# Altium project UNIT_V3_LVDS_Board.PrjPcb
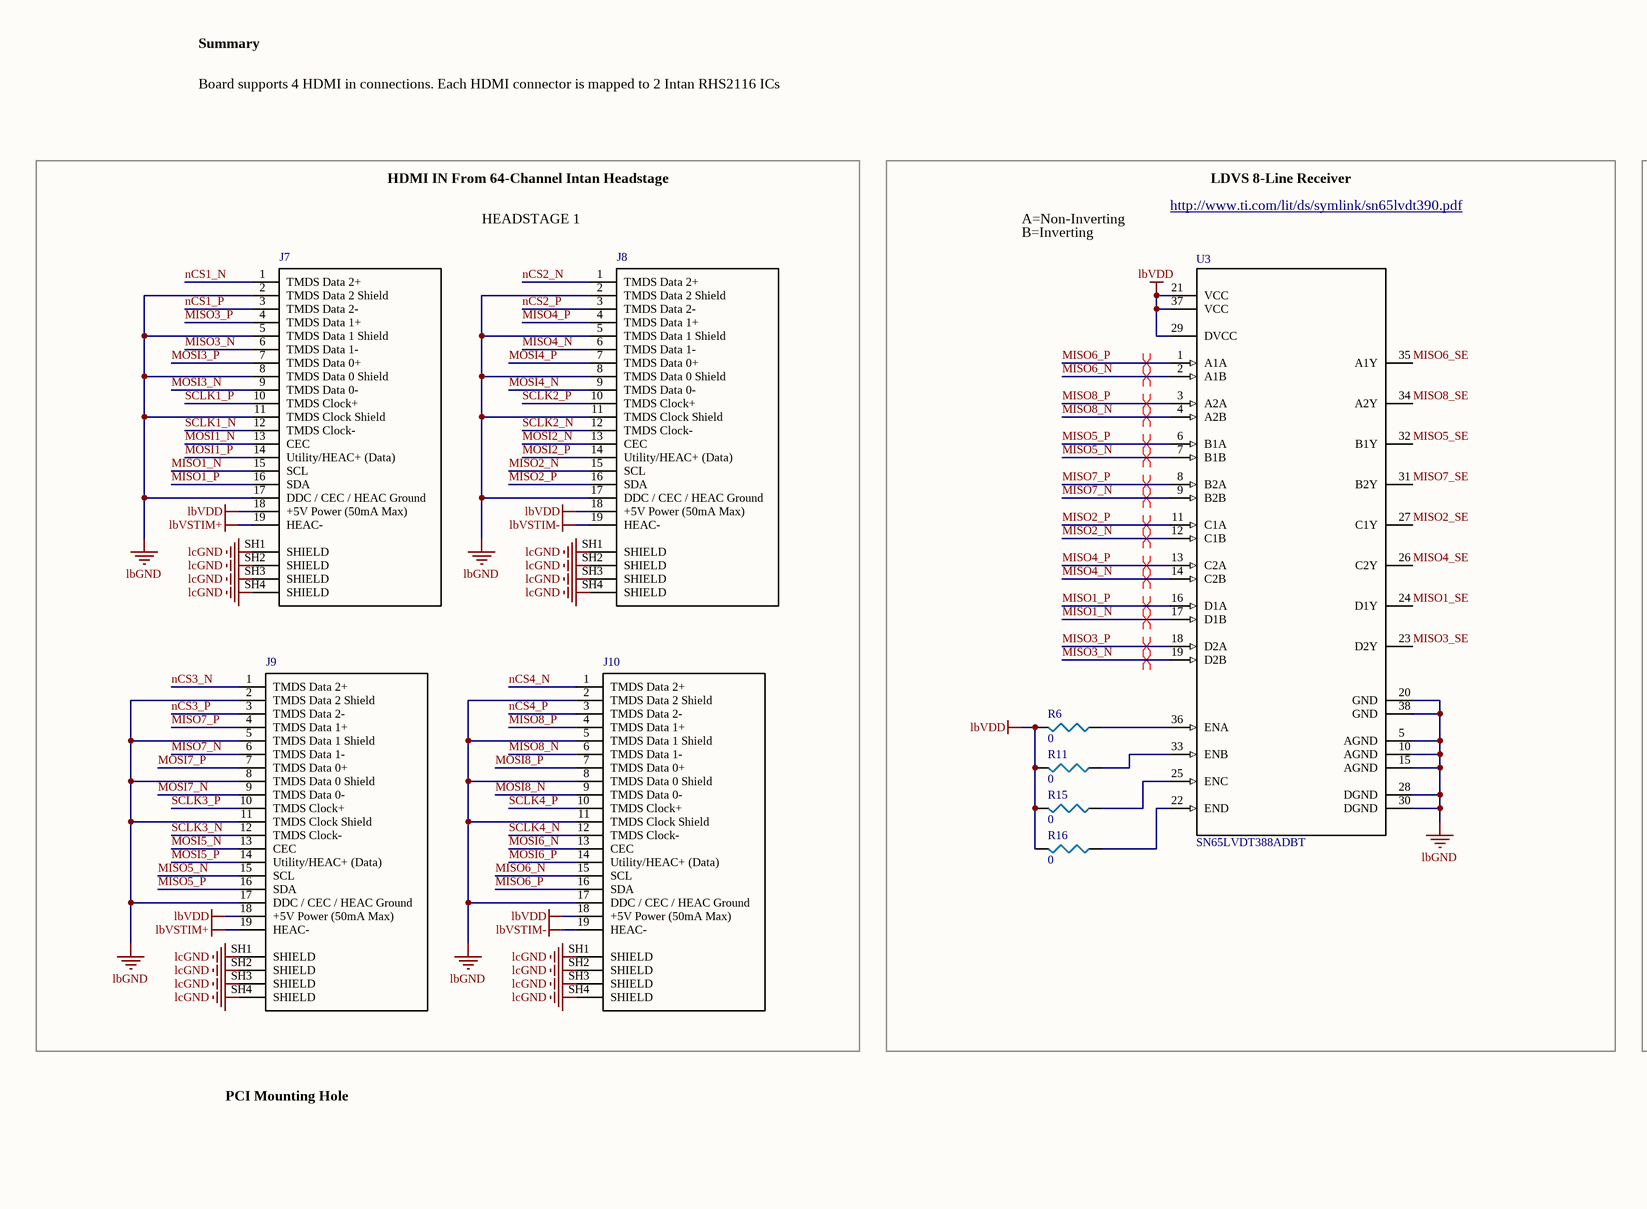
[diagram p0: UNIT_V3_LVDS_Board.SchDoc, left]
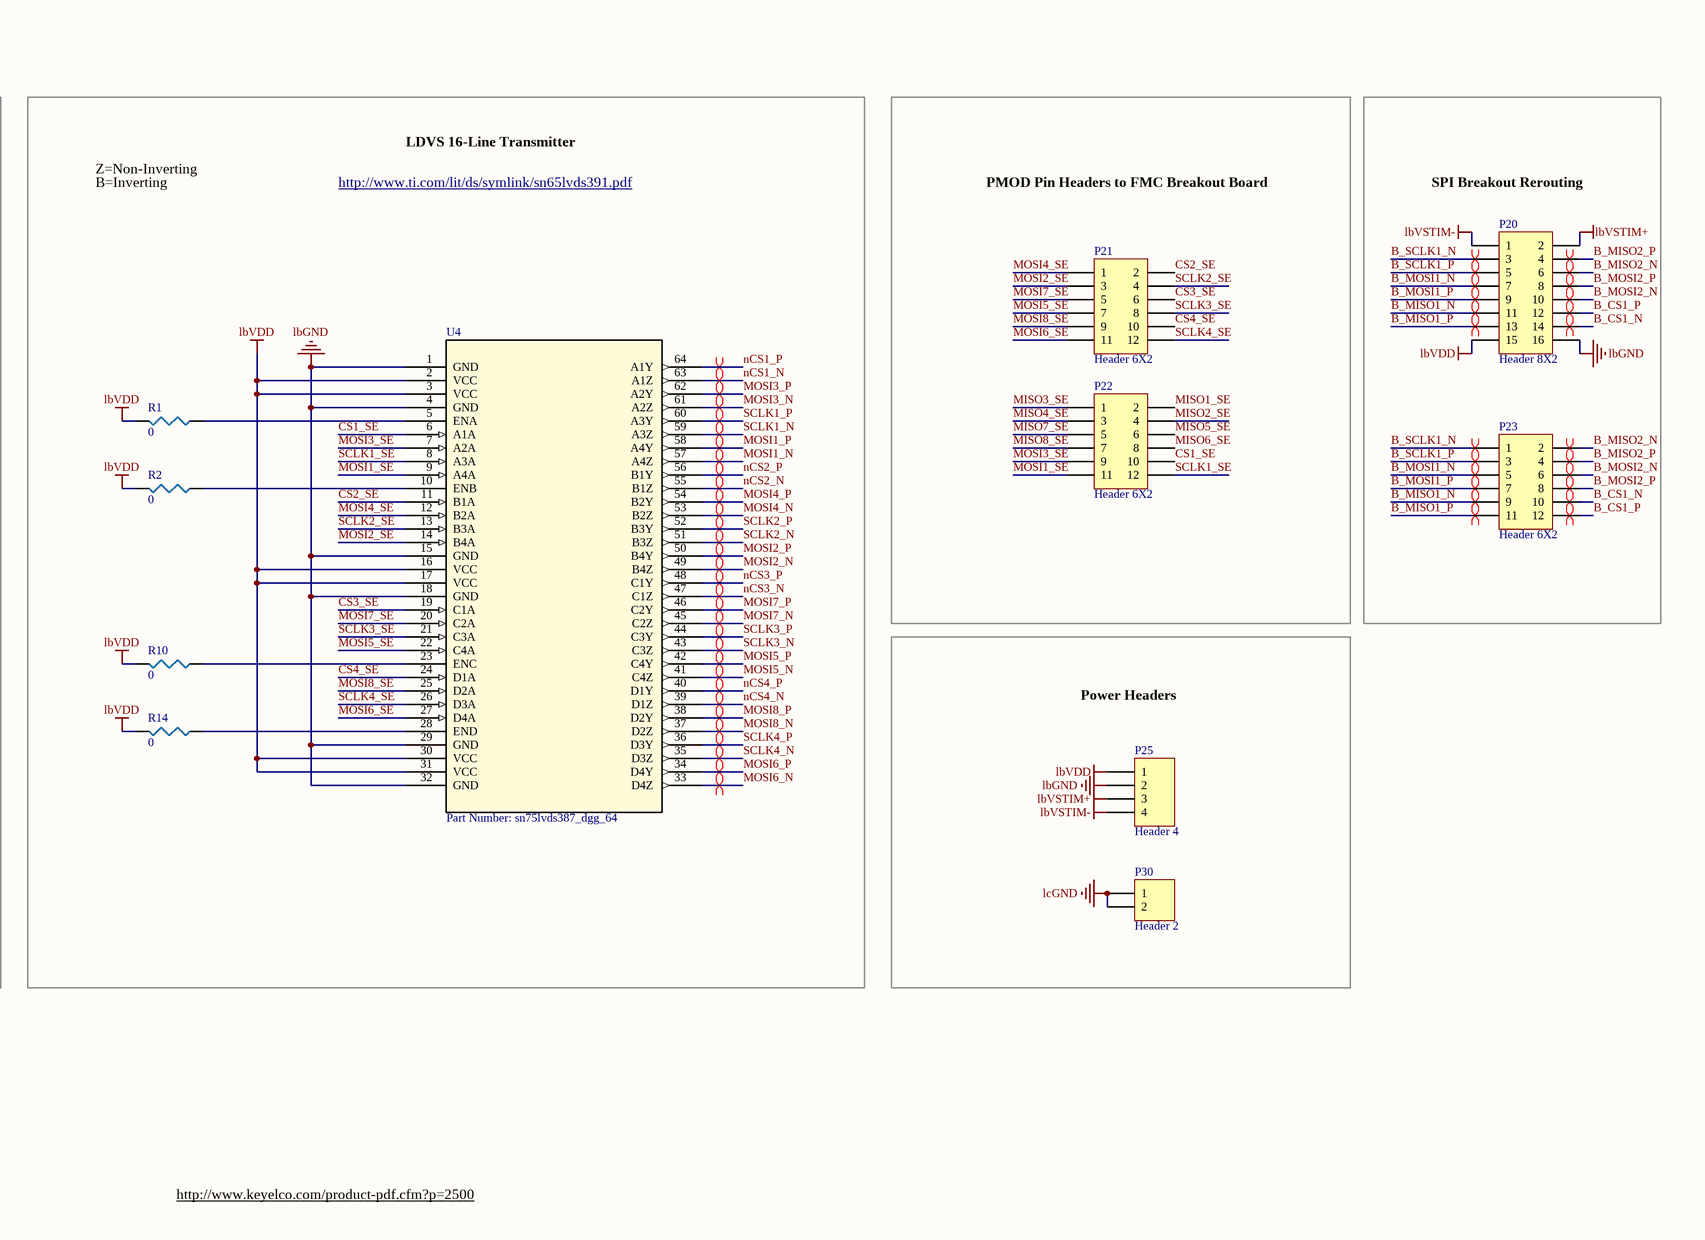
[diagram p1: UNIT_V3_LVDS_Board.SchDoc, right]
1 sheet, 20 parts. Net scope: global (net labels, ports and power ports of the same name join across sheets).
Board file: UNIT_V3_LVDS_Board.PcbDoc

## Sheet UNIT_V3_LVDS_Board.SchDoc
size 635 x 254 mm

### Parts
J7  1747981-2  [TE_1747981-2_1747981-2(Primary)]  (value not drawn)
J8  1747981-2  [TE_1747981-2_1747981-2(Primary)]  (value not drawn)
J9  1747981-2  [TE_1747981-2_1747981-2(Primary)]  (value not drawn)
J10  1747981-2  [TE_1747981-2_1747981-2(Primary)]  (value not drawn)
P20  Header 8X2  [TE_534998-8]
P21  Header 6X2  [0010897120]
P22  Header 6X2  [0010897120]
P23  Header 6X2  [0010897120]
P25  Header 4  [OSTVN04A150]
P30  Header 2  [OSTVN02A150]
R1  0  [R0805]
R2  0  [R0805]
R6  0  [R0805]
R10  0  [R0805]
R11  0  [R0805]
R14  0  [R0805]
R15  0  [R0805]
R16  0  [R0805]
U3  SN65LVDT388ADBT  [DBT0038A_N]
U4  Part Number: sn75lvds387_dgg_64  [DGG64]

### Blocks framed on the sheet
PMOD Pin Headers to FMC Breakout Board: P21 P22
SPI Breakout Rerouting: P20 P23
Power Headers: P25 P30

### Nets
lbGND: J7.2(TMDS_Data_2_Shield) J7.5(TMDS_Data_1_Shield) J7.8(TMDS_Data_0_Shield) J7.11(TMDS_Clock_Shield) J7.17(DDC_/_CEC_/_HEAC_Ground) J8.2(TMDS_Data_2_Shield) J8.5(TMDS_Data_1_Shield) J8.8(TMDS_Data_0_Shield) J8.11(TMDS_Clock_Shield) J8.17(DDC_/_CEC_/_HEAC_Ground) J9.2(TMDS_Data_2_Shield) J9.5(TMDS_Data_1_Shield) J9.8(TMDS_Data_0_Shield) J9.11(TMDS_Clock_Shield) J9.17(DDC_/_CEC_/_HEAC_Ground) J10.2(TMDS_Data_2_Shield) J10.5(TMDS_Data_1_Shield) J10.8(TMDS_Data_0_Shield) J10.11(TMDS_Clock_Shield) J10.17(DDC_/_CEC_/_HEAC_Ground) P20.16 P25.2 U3.5(AGND) U3.10(AGND) U3.15(AGND) U3.20(GND) U3.28(DGND) U3.30(DGND) U3.38(GND) U4.1(GND) U4.4(GND) U4.15(GND) U4.18(GND) U4.29(GND) U4.32(GND)
lbVDD: J7.18(+5V_Power_(50mA_Max)) J8.18(+5V_Power_(50mA_Max)) J9.18(+5V_Power_(50mA_Max)) J10.18(+5V_Power_(50mA_Max)) P20.15 P25.1 R1.2 R2.2 R6.2 R10.2 R11.2 R14.2 R15.2 R16.2 U3.21(VCC) U3.29(DVCC) U3.37(VCC) U4.2(VCC) U4.3(VCC) U4.16(VCC) U4.17(VCC) U4.30(VCC) U4.31(VCC)
lbVSTIM+: J7.19(HEAC-) J9.19(HEAC-) P20.2 P25.3
lbVSTIM-: J8.19(HEAC-) J10.19(HEAC-) P20.1 P25.4
lcGND: J7.SH1(SHIELD) J7.SH2(SHIELD) J7.SH3(SHIELD) J7.SH4(SHIELD) J8.SH1(SHIELD) J8.SH2(SHIELD) J8.SH3(SHIELD) J8.SH4(SHIELD) J9.SH1(SHIELD) J9.SH2(SHIELD) J9.SH3(SHIELD) J9.SH4(SHIELD) J10.SH1(SHIELD) J10.SH2(SHIELD) J10.SH3(SHIELD) J10.SH4(SHIELD) P30.1 P30.2
B_CS1_N: P20.14 P23.10
B_CS1_P: P20.12 P23.12
B_MISO1_N: P20.11 P23.9
B_MISO1_P: P20.13 P23.11
B_MISO2_N: P20.6 P23.2
B_MISO2_P: P20.4 P23.4
B_MOSI1_N: P20.7 P23.5
B_MOSI1_P: P20.9 P23.7
B_MOSI2_N: P20.10 P23.6
B_MOSI2_P: P20.8 P23.8
B_SCLK1_N: P20.3 P23.1
B_SCLK1_P: P20.5 P23.3
CS1_SE: P22.10 U4.6(A1A)
CS2_SE: P21.2 U4.11(B1A)
CS3_SE: P21.6 U4.19(C1A)
CS4_SE: P21.10 U4.24(D1A)
MISO1_N: J7.15(SCL) U3.17(D1B)
MISO1_P: J7.16(SDA) U3.16(D1A)
MISO1_SE: P22.2 U3.24(D1Y)
MISO2_N: J8.15(SCL) U3.12(C1B)
MISO2_P: J8.16(SDA) U3.11(C1A)
MISO2_SE: P22.4 U3.27(C1Y)
MISO3_N: J7.6(TMDS_Data_1-) U3.19(D2B)
MISO3_P: J7.4(TMDS_Data_1+) U3.18(D2A)
MISO3_SE: P22.1 U3.23(D2Y)
MISO4_N: J8.6(TMDS_Data_1-) U3.14(C2B)
MISO4_P: J8.4(TMDS_Data_1+) U3.13(C2A)
MISO4_SE: P22.3 U3.26(C2Y)
MISO5_N: J9.15(SCL) U3.7(B1B)
MISO5_P: J9.16(SDA) U3.6(B1A)
MISO5_SE: P22.6 U3.32(B1Y)
MISO6_N: J10.15(SCL) U3.2(A1B)
MISO6_P: J10.16(SDA) U3.1(A1A)
MISO6_SE: P22.8 U3.35(A1Y)
MISO7_N: J9.6(TMDS_Data_1-) U3.9(B2B)
MISO7_P: J9.4(TMDS_Data_1+) U3.8(B2A)
MISO7_SE: P22.5 U3.31(B2Y)
MISO8_N: J10.6(TMDS_Data_1-) U3.4(A2B)
MISO8_P: J10.4(TMDS_Data_1+) U3.3(A2A)
MISO8_SE: P22.7 U3.34(A2Y)
MOSI1_N: J7.13(CEC) U4.57(A4Z)
MOSI1_P: J7.14(Utility/HEAC+_(Data)) U4.58(A4Y)
MOSI1_SE: P22.11 U4.9(A4A)
MOSI2_N: J8.13(CEC) U4.49(B4Z)
MOSI2_P: J8.14(Utility/HEAC+_(Data)) U4.50(B4Y)
MOSI2_SE: P21.3 U4.14(B4A)
MOSI3_N: J7.9(TMDS_Data_0-) U4.61(A2Z)
MOSI3_P: J7.7(TMDS_Data_0+) U4.62(A2Y)
MOSI3_SE: P22.9 U4.7(A2A)
MOSI4_N: J8.9(TMDS_Data_0-) U4.53(B2Z)
MOSI4_P: J8.7(TMDS_Data_0+) U4.54(B2Y)
MOSI4_SE: P21.1 U4.12(B2A)
MOSI5_N: J9.13(CEC) U4.41(C4Z)
MOSI5_P: J9.14(Utility/HEAC+_(Data)) U4.42(C4Y)
MOSI5_SE: P21.7 U4.22(C4A)
MOSI6_N: J10.13(CEC) U4.33(D4Z)
MOSI6_P: J10.14(Utility/HEAC+_(Data)) U4.34(D4Y)
MOSI6_SE: P21.11 U4.27(D4A)
MOSI7_N: J9.9(TMDS_Data_0-) U4.45(C2Z)
MOSI7_P: J9.7(TMDS_Data_0+) U4.46(C2Y)
MOSI7_SE: P21.5 U4.20(C2A)
MOSI8_N: J10.9(TMDS_Data_0-) U4.37(D2Z)
MOSI8_P: J10.7(TMDS_Data_0+) U4.38(D2Y)
MOSI8_SE: P21.9 U4.25(D2A)
nCS1_N: J7.1(TMDS_Data_2+) U4.63(A1Z)
nCS1_P: J7.3(TMDS_Data_2-) U4.64(A1Y)
nCS2_N: J8.1(TMDS_Data_2+) U4.55(B1Z)
nCS2_P: J8.3(TMDS_Data_2-) U4.56(B1Y)
nCS3_N: J9.1(TMDS_Data_2+) U4.47(C1Z)
nCS3_P: J9.3(TMDS_Data_2-) U4.48(C1Y)
nCS4_N: J10.1(TMDS_Data_2+) U4.39(D1Z)
nCS4_P: J10.3(TMDS_Data_2-) U4.40(D1Y)
SCLK1_N: J7.12(TMDS_Clock-) U4.59(A3Z)
SCLK1_P: J7.10(TMDS_Clock+) U4.60(A3Y)
SCLK1_SE: P22.12 U4.8(A3A)
SCLK2_N: J8.12(TMDS_Clock-) U4.51(B3Z)
SCLK2_P: J8.10(TMDS_Clock+) U4.52(B3Y)
SCLK2_SE: P21.4 U4.13(B3A)
SCLK3_N: J9.12(TMDS_Clock-) U4.43(C3Z)
SCLK3_P: J9.10(TMDS_Clock+) U4.44(C3Y)
SCLK3_SE: P21.8 U4.21(C3A)
SCLK4_N: J10.12(TMDS_Clock-) U4.35(D3Z)
SCLK4_P: J10.10(TMDS_Clock+) U4.36(D3Y)
SCLK4_SE: P21.12 U4.26(D3A)
NetR1_1: R1.1 U4.5(ENA)
NetR2_1: R2.1 U4.10(ENB)
NetR6_1: R6.1 U3.36(ENA)
NetR10_1: R10.1 U4.23(ENC)
NetR11_1: R11.1 U3.33(ENB)
NetR14_1: R14.1 U4.28(END)
NetR15_1: R15.1 U3.25(ENC)
NetR16_1: R16.1 U3.22(END)

### Layout directives
differential pair: (no net found under the mark), B_MISO1_N, B_MISO1_P, B_MOSI1_N, B_MOSI1_P, B_SCLK1_N, B_SCLK1_P, MISO1_N, MISO1_P, MISO2_N, MISO2_P, MISO3_N, MISO3_P, MISO4_N, MISO4_P, MISO5_N, MISO5_P, MISO6_N, MISO6_P, MISO7_N, MISO7_P, MISO8_N, MISO8_P, MOSI1_N, MOSI1_P, MOSI2_N, MOSI2_P, MOSI3_N, MOSI3_P, MOSI4_N, MOSI4_P, MOSI5_N, MOSI5_P, MOSI6_N, MOSI6_P, MOSI7_N, MOSI7_P, MOSI8_N, MOSI8_P, nCS1_N, nCS1_P, nCS2_N, nCS2_P, nCS3_N, nCS3_P, nCS4_N, nCS4_P, SCLK1_N, SCLK1_P, SCLK2_N, SCLK2_P, SCLK3_N, SCLK3_P, SCLK4_N, SCLK4_P

### Notes on the sheet
- Summary
- Board supports 4 HDMI in connections. Each HDMI connector is mapped to 2 Intan RHS2116 ICs
- HDMI IN From 64-Channel Intan Headstage
- LDVS 8-Line Receiver
- HEADSTAGE 1
- A=Non-Inverting
- B=Inverting
- http://www.ti.com/lit/ds/symlink/sn65lvdt390.pdf
- Z=Non-Inverting
- http://www.ti.com/lit/ds/symlink/sn65lvds391.pdf
- LDVS 16-Line Transmitter
- PCI Mounting Hole
- http://www.keyelco.com/product-pdf.cfm?p=2500

### Library data of the parts
J7-J10 = 1747981-2: Conn HDMI RCP 19 POS 0.5mm Solder ST SMD 19 Terminal 1 Port T/R; MF: TE Connectivity; Detailed Description: HDMI Receptacle Connector 19 Position Panel Mount; Surface Mount, Right Angle; Through Hole; Pricing1: 1  6.31000  $6.31  10  6.04800  $60.48  25  5.54400  $138.60  50  5.29240  $264.62  100  5.04030  $504.03 (CAD); TE_purchase_URL: https://www.te.com/usa-en/product-1747981-2.html?te_bu=Cor&te_type=disp&te_campaign=seda_glo_cor-seda-global-disp-prtnr-fy19-seda-model-bom-cta_sma-317_1&elqCampaignId=32493; SnapEDA_Link: https://www.snapeda.com/parts/1747981-2/TE%20Connectivity%20AMP%20Connectors/view-part/?ref=snap; Package: None; MP: 1747981-2; EU_RoHS_Compliance: Compliant; Availability: Unavailable; Price: None; Value: *; ComponentLink1Description: Datasheet; ComponentLink1URL: https://www.te.com/commerce/DocumentDelivery/DDEController?Action=srchrtrv&DocNm=1747981&DocType=Customer+Drawing&DocLang=English; Manufacturer: TE Connectivity; Manufacturer Part Number: 1747981-2; Stock1: 1,426; Supplier 1: Digikey; Supplier Link 1: https://www.digikey.ca/product-detail/en/te-connectivity-amp-connectors/1747981-2/A130924CT-ND/8602669; Supplier Part Number 1: A130924CT-ND
P20 = Header 8X2: Header, 8-Pin, Dual row; Manufacturer: TE Connectivity; Manufacturer Part Number: 534998-8; Pricing1: 1  5.59000  $5.59  28  4.92321  $137.85  112  4.47580  $501.29  504  3.80446  $1,917.45  1,008  3.24498  $3,270.94 (CAD); LatestRevisionDate: 17-Jul-2002; LatestRevisionNote: Re-released for DXP Platform.; Publisher: Altium Limited; ComponentLink1Description: Datasheet; ComponentLink1URL: https://www.te.com/commerce/DocumentDelivery/DDEController?Action=srchrtrv&DocNm=534998&DocType=Customer+Drawing&DocLang=English; Stock1: 13,776; Supplier 1: Digikey; Supplier Link 1: https://www.digikey.ca/product-detail/en/te-connectivity-amp-connectors/534998-8/A26489-ND/298054; Supplier Part Number 1: A26489-ND
P21-P23 = Header 6X2: Header, 6-Pin, Dual row; Manufacturer: Molex; Pricing1: 1  1.65000  $1.65 (CAD); LatestRevisionDate: 17-Jul-2002; LatestRevisionNote: Re-released for DXP Platform.; ComponentLink1Description: Datasheet; ComponentLink1URL: https://www.molex.com/pdm_docs/sd/010897120_sd.pdf; Manufacturer Part Number: 0010897120; Manufacturer Link: https://www.molex.com/molex/products/datasheet.jsp?part=active/0010897120_PCB_HEADERS.xml; Supplier 1: Digikey; Supplier Part Number 1: WM13108-ND; Supplier Link 1: https://www.digikey.com/product-detail/en/molex/0010897120/WM13108-ND/3068090; Stock1: 2,645
  P22 P23: Publisher: Altium Limited
P25 = Header 4: Header, 4-Pin; Manufacturer: On Shore Technology Inc.; Detailed Description: 4 Position Wire to Board Terminal Block Horizontal with Board 0.100" (2.54mm) Through Hole; Pitch (Imperial): 100mil; LatestRevisionDate: 17-Jul-2002; LatestRevisionNote: Re-released for DXP Platform.; Publisher: Altium Limited; Manufacturer Part Number: OSTVN04A150; Manufacturer Link: https://www.on-shore.com/part/ostvnxxa150-terminal-block-one-piece-rising-clamp/; Supplier 1: Digikey; Supplier Link 1: https://www.digikey.com/product-detail/en/on-shore-technology-inc/OSTVN04A150/ED10563-ND/1588864; Supplier Part Number 1: ED10563-ND; Pricing 1: 1  1.38000  $1.38  10  0.96900  $9.69  25  0.90400  $22.60  50  0.82040  $41.02  100  0.81680  $81.68  250  0.68972  $172.43  500  0.65340  $326.70  1,000  0.58080  $580.80  5,000  0.47190  $2,359.50 (CAD); Stock 1: 8,195; ComponentLink1URL: http://www.on-shore.com/wp-content/uploads/OSTVNXXA150.pdf; ComponentLink1Description: Datasheet
P30 = Header 2: Header, 2-Pin; Manufacturer: On Shore Technology Inc.; Pricing1: 1  1.29000  $1.29 (CAD); LatestRevisionDate: 17-Jul-2002; LatestRevisionNote: Re-released for DXP Platform.; Publisher: Altium Limited; Manufacturer Part Number: OSTVN02A150; Manufacturer Link: https://www.on-shore.com/part/ostvnxxa150-terminal-block-one-piece-rising-clamp/; Supplier 1: Digikey; Supplier Part Number 1: ED10561-ND; Supplier Link 1: https://www.digikey.ca/product-detail/en/on-shore-technology-inc/OSTVN02A150/ED10561-ND/1588862; Stock1: 21,116
R1 R2 R6 R10 R11 R14-R16 = RES0: RC0805JR-070RL; Manufacturer: Yageo; Tolerance: 1%; Resistance: 0R; Temperature Coefficient: 100ppm/°C; Power Rating: 125mW; Voltage Rating: 150V; Supplier 1: Digi-Key; Manufacturer Part Number: RC0805JR-070RL; Stock 1: 3924855; Pricing 1: 1=0.15;  10=0.055;  25=0.0408;  50=0.0308;  100=0.0229;  250=0.01740;  500=0.0139;  1000=0.01024 (CAD); Case/Package: 0805; Case Code (Metric): 2012; Case Code (Imperial): 0805; Min Operating Temperature: -55°C; Max Operating Temperature: 155°C; Packaging: Tape and Reel; Composition: Thick Film; Package Quantity: 1; Number of Terminations: 2; Termination: SMD/SMT; Military Standard: Not; Max Power Dissipation: 125mW; Length: 2mm; Depth: 1.25mm; REACH SVHC: Unknown; Lead Free: Lead Free; Supplier Part Number 1: 311-0.0ARCT-ND; Supplier Link 1: https://www.digikey.ca/product-detail/en/yageo/RC0805JR-070RL/311-0.0ARCT-ND/731163
U3 = SN65LVDT388ADBTR: IC OCTAL LVDS RECEIVER 38-TSSOP; Manufacturer: Texas Instruments; Pricing1: Price Break  Unit Price  Extended Price  1  6.13000  $6.13  10  5.51000  $55.10  50  5.20880  $260.44  100  4.51430  $451.43  500  3.84290  $1,921.45  1,000  3.24100  $3,241.00  2,500  3.07895  $7,697.38 (CAD); PartNumber: SN65LVDT388ADBTR; RefDes: RefDes; Type: DEV; Value: Value; Copyright: Copyright (C) 2018 Accelerated Designs. All rights reserved; Manufacturer Part Number: SN65LVDT388ADBT; Manufacturer Link: http://www.ti.com/product/SN65LVDT388A?keyMatch=SN65LVDT388A&tisearch=Search-EN-Products; Supplier 1: Digikey; Supplier Part Number 1: 296-6899-5-ND; Supplier Link 1: https://www.digikey.com/products/en?mpart=SN65LVDT388ADBT&v=296; Stock1: 5,642
U4 = SN75LVDS387_DGG_64: 16-Channel LVDS Transmitter; Manufacturer: Texas Instruments; Manufacturer Part Number: SN75LVDS387DGG; INDUSTRY_STD_PKG_TYPE: TSSOP; FAMILY_NAME: LVDS PHY (<800MBPS); PIN_COUNT: 64; PACKAGE_DESIGNATOR: DGG; Pricing1: Price Break  Unit Price  Extended Price  1  11.73000  $11.73  10  10.59500  $105.95  25  10.10240  $252.56  100  8.77180  $877.18  500  7.63840  $3,819.20  1,000  6.65280  $6,652.80 (CAD); Datasheet_URL: http://www.ti.com/lit/gpn/SN75LVDS387; GENERIC_PART_NUMBER: SN75LVDS387; Vendor: Texas Instruments; Manufacturer_Part_Number: sn75lvds387_dgg_64; Copyright: Copyright (C) 2018 Accelerated Designs. All rights reserved; RefDes: RefDes; Type: DEV; Value: Value; Manufacturer Link: http://www.ti.com/product/SN75LVDS387; Supplier 1: Digikey; Supplier Part Number 1: 296-2367-5-ND; Supplier Link 1: https://www.digikey.com/products/en?mpart=SN75LVDS387DGG&v=296; Stock1: 3,375